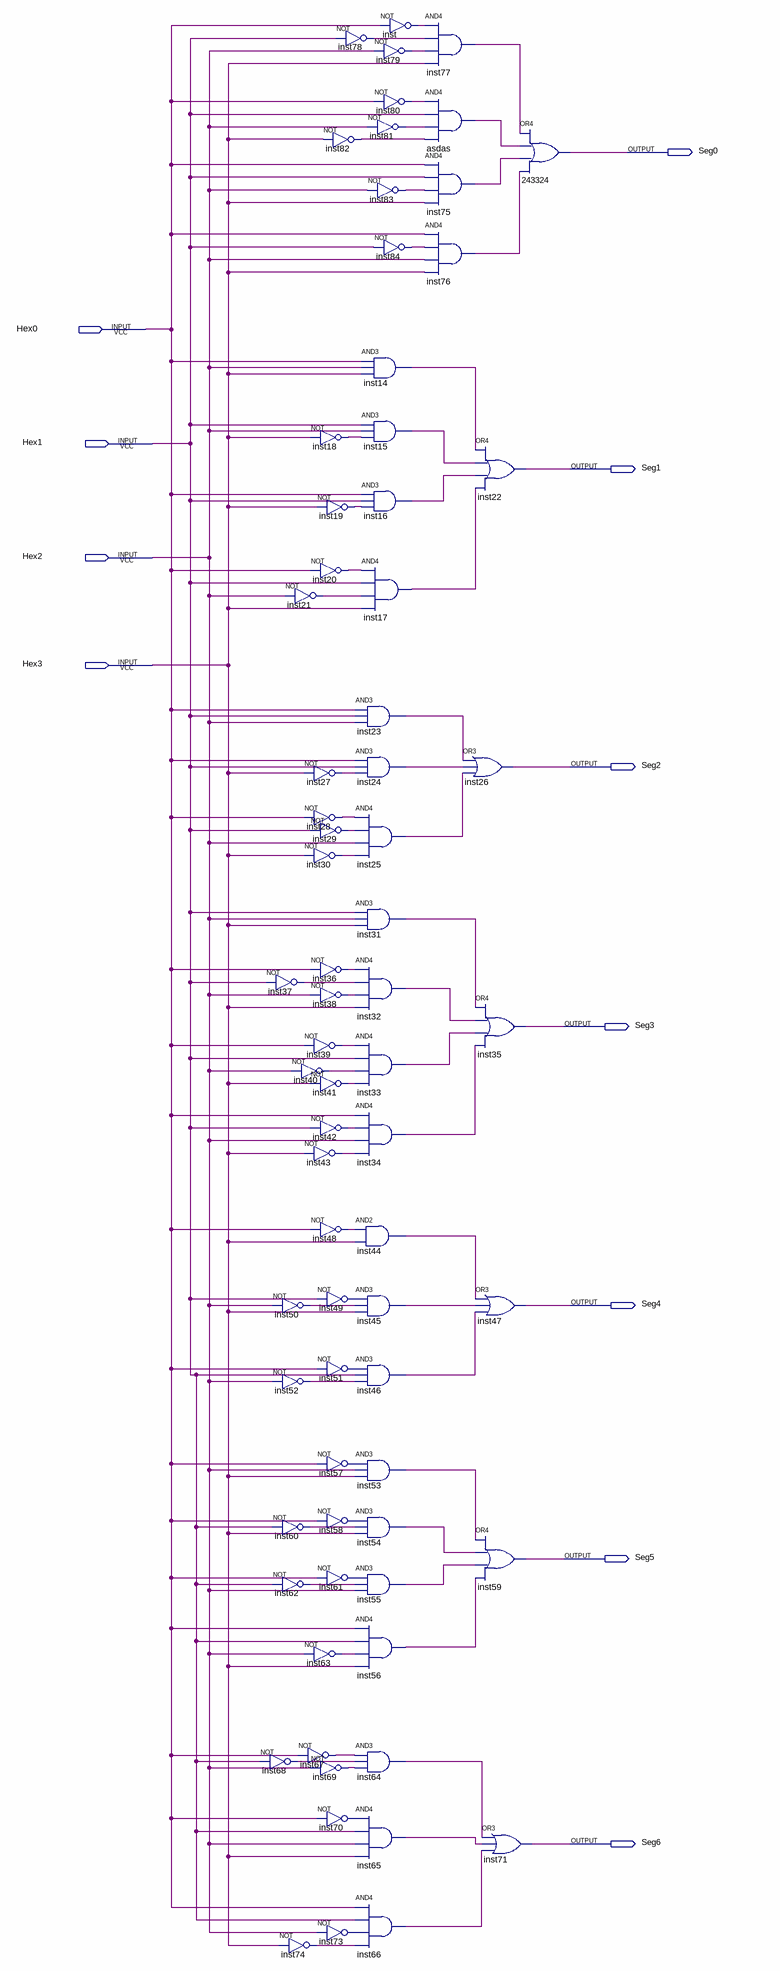
[diagram p0: schematic sheet]
// Quartus schematic Block3.bdf as structural Verilog: 73 symbols, 11 pins
module Block3 (
  input  Hex0,
  input  Hex1,
  input  Hex2,
  input  Hex3,
  output Seg0,
  output Seg1,
  output Seg2,
  output Seg3,
  output Seg4,
  output Seg5,
  output Seg6
);

  wire asdas_out, inst14_out, inst15_out, inst16_out, inst17_out, inst18_out, inst19_out, inst20_out,
       inst21_out, inst23_out, inst24_out, inst25_out, inst27_out, inst28_out, inst29_out, inst30_out,
       inst31_out, inst32_out, inst33_out, inst34_out, inst36_out, inst37_out, inst38_out, inst39_out,
       inst40_out, inst41_out, inst42_out, inst43_out, inst44_out, inst45_out, inst46_out, inst48_out,
       inst49_out, inst50_out, inst51_out, inst52_out, inst53_out, inst54_out, inst55_out, inst56_out,
       inst57_out, inst58_out, inst60_out, inst61_out, inst62_out, inst63_out, inst64_out, inst65_out,
       inst66_out, inst67_out, inst68_out, inst69_out, inst70_out, inst73_out, inst74_out, inst75_out,
       inst76_out, inst77_out, inst78_out, inst79_out, inst80_out, inst81_out, inst82_out, inst83_out,
       inst84_out, inst_out;

  not inst37 (inst37_out, Hex1);
  not inst50 (inst50_out, Hex2);
  not inst52 (inst52_out, Hex2);
  not inst60 (inst60_out, Hex1);
  not inst62 (inst62_out, Hex1);
  not inst68 (inst68_out, Hex1);
  not inst74 (inst74_out, Hex3);
  not inst82 (inst82_out, Hex3);
  not inst18 (inst18_out, Hex3);
  not inst19 (inst19_out, Hex3);
  not inst20 (inst20_out, Hex0);
  not inst21 (inst21_out, Hex2);
  not inst27 (inst27_out, Hex3);
  not inst28 (inst28_out, Hex0);
  not inst29 (inst29_out, Hex1);
  not inst30 (inst30_out, Hex3);
  not inst36 (inst36_out, Hex0);
  not inst38 (inst38_out, Hex2);
  not inst39 (inst39_out, Hex0);
  not inst40 (inst40_out, Hex2);
  not inst41 (inst41_out, Hex3);
  not inst42 (inst42_out, Hex1);
  not inst43 (inst43_out, Hex3);
  not inst48 (inst48_out, Hex0);
  not inst49 (inst49_out, Hex1);
  not inst51 (inst51_out, Hex0);
  not inst57 (inst57_out, Hex0);
  not inst58 (inst58_out, Hex0);
  not inst61 (inst61_out, Hex0);
  not inst63 (inst63_out, Hex2);
  not inst67 (inst67_out, Hex0);
  not inst69 (inst69_out, Hex2);
  not inst70 (inst70_out, Hex0);
  not inst73 (inst73_out, Hex2);
  not inst (inst_out, Hex0);
  not inst78 (inst78_out, Hex1);
  not inst79 (inst79_out, Hex2);
  not inst80 (inst80_out, Hex0);
  not inst81 (inst81_out, Hex2);
  not inst83 (inst83_out, Hex2);
  not inst84 (inst84_out, Hex1);
  and inst14 (inst14_out, Hex0, Hex2, Hex3);
  and inst15 (inst15_out, Hex1, Hex2, inst18_out);
  and inst16 (inst16_out, Hex0, Hex1, inst19_out);
  and inst17 (inst17_out, inst20_out, Hex1, inst21_out, Hex3);
  and inst23 (inst23_out, Hex0, Hex1, Hex2);
  and inst24 (inst24_out, Hex0, Hex1, inst27_out);
  and inst25 (inst25_out, inst28_out, inst29_out, Hex2, inst30_out);
  and inst31 (inst31_out, Hex1, Hex2, Hex3);
  and inst32 (inst32_out, inst36_out, inst37_out, inst38_out, Hex3);
  and inst33 (inst33_out, inst39_out, Hex1, inst40_out, inst41_out);
  and inst34 (inst34_out, Hex0, inst42_out, Hex2, inst43_out);
  and inst44 (inst44_out, inst48_out, Hex3);
  and inst45 (inst45_out, inst49_out, inst50_out, Hex3);
  and inst46 (inst46_out, inst51_out, Hex1, inst52_out);
  and inst53 (inst53_out, inst57_out, Hex2, Hex3);
  and inst54 (inst54_out, inst58_out, inst60_out, Hex3);
  and inst55 (inst55_out, inst61_out, inst62_out, Hex2);
  and inst56 (inst56_out, Hex0, Hex1, inst63_out, Hex3);
  and inst64 (inst64_out, inst67_out, inst68_out, inst69_out);
  and inst65 (inst65_out, inst70_out, Hex1, Hex2, Hex3);
  and inst66 (inst66_out, Hex0, Hex1, inst73_out, inst74_out);
  and inst77 (inst77_out, inst_out, inst78_out, inst79_out, Hex3);
  and asdas (asdas_out, inst80_out, Hex1, inst81_out, inst82_out);
  and inst75 (inst75_out, Hex0, Hex1, inst83_out, Hex3);
  and inst76 (inst76_out, Hex0, inst84_out, Hex2, Hex3);
  or inst22 (Seg1, inst14_out, inst15_out, inst16_out, inst17_out);
  or inst26 (Seg2, inst23_out, inst24_out, inst25_out);
  or inst35 (Seg3, inst31_out, inst32_out, inst33_out, inst34_out);
  or inst47 (Seg4, inst44_out, inst45_out, inst46_out);
  or inst59 (Seg5, inst53_out, inst54_out, inst55_out, inst56_out);
  or inst71 (Seg6, inst64_out, inst65_out, inst66_out);
  or u_243324 (Seg0, inst77_out, asdas_out, inst75_out, inst76_out);
endmodule
